# EasyEDA schematic Sheet_1.json
TITLE: Sheet_1; REV: 1.0; Date: 2025-07-18; Sheet: 1/1; Drawn By: hunarbatra1414; Company: Your Company
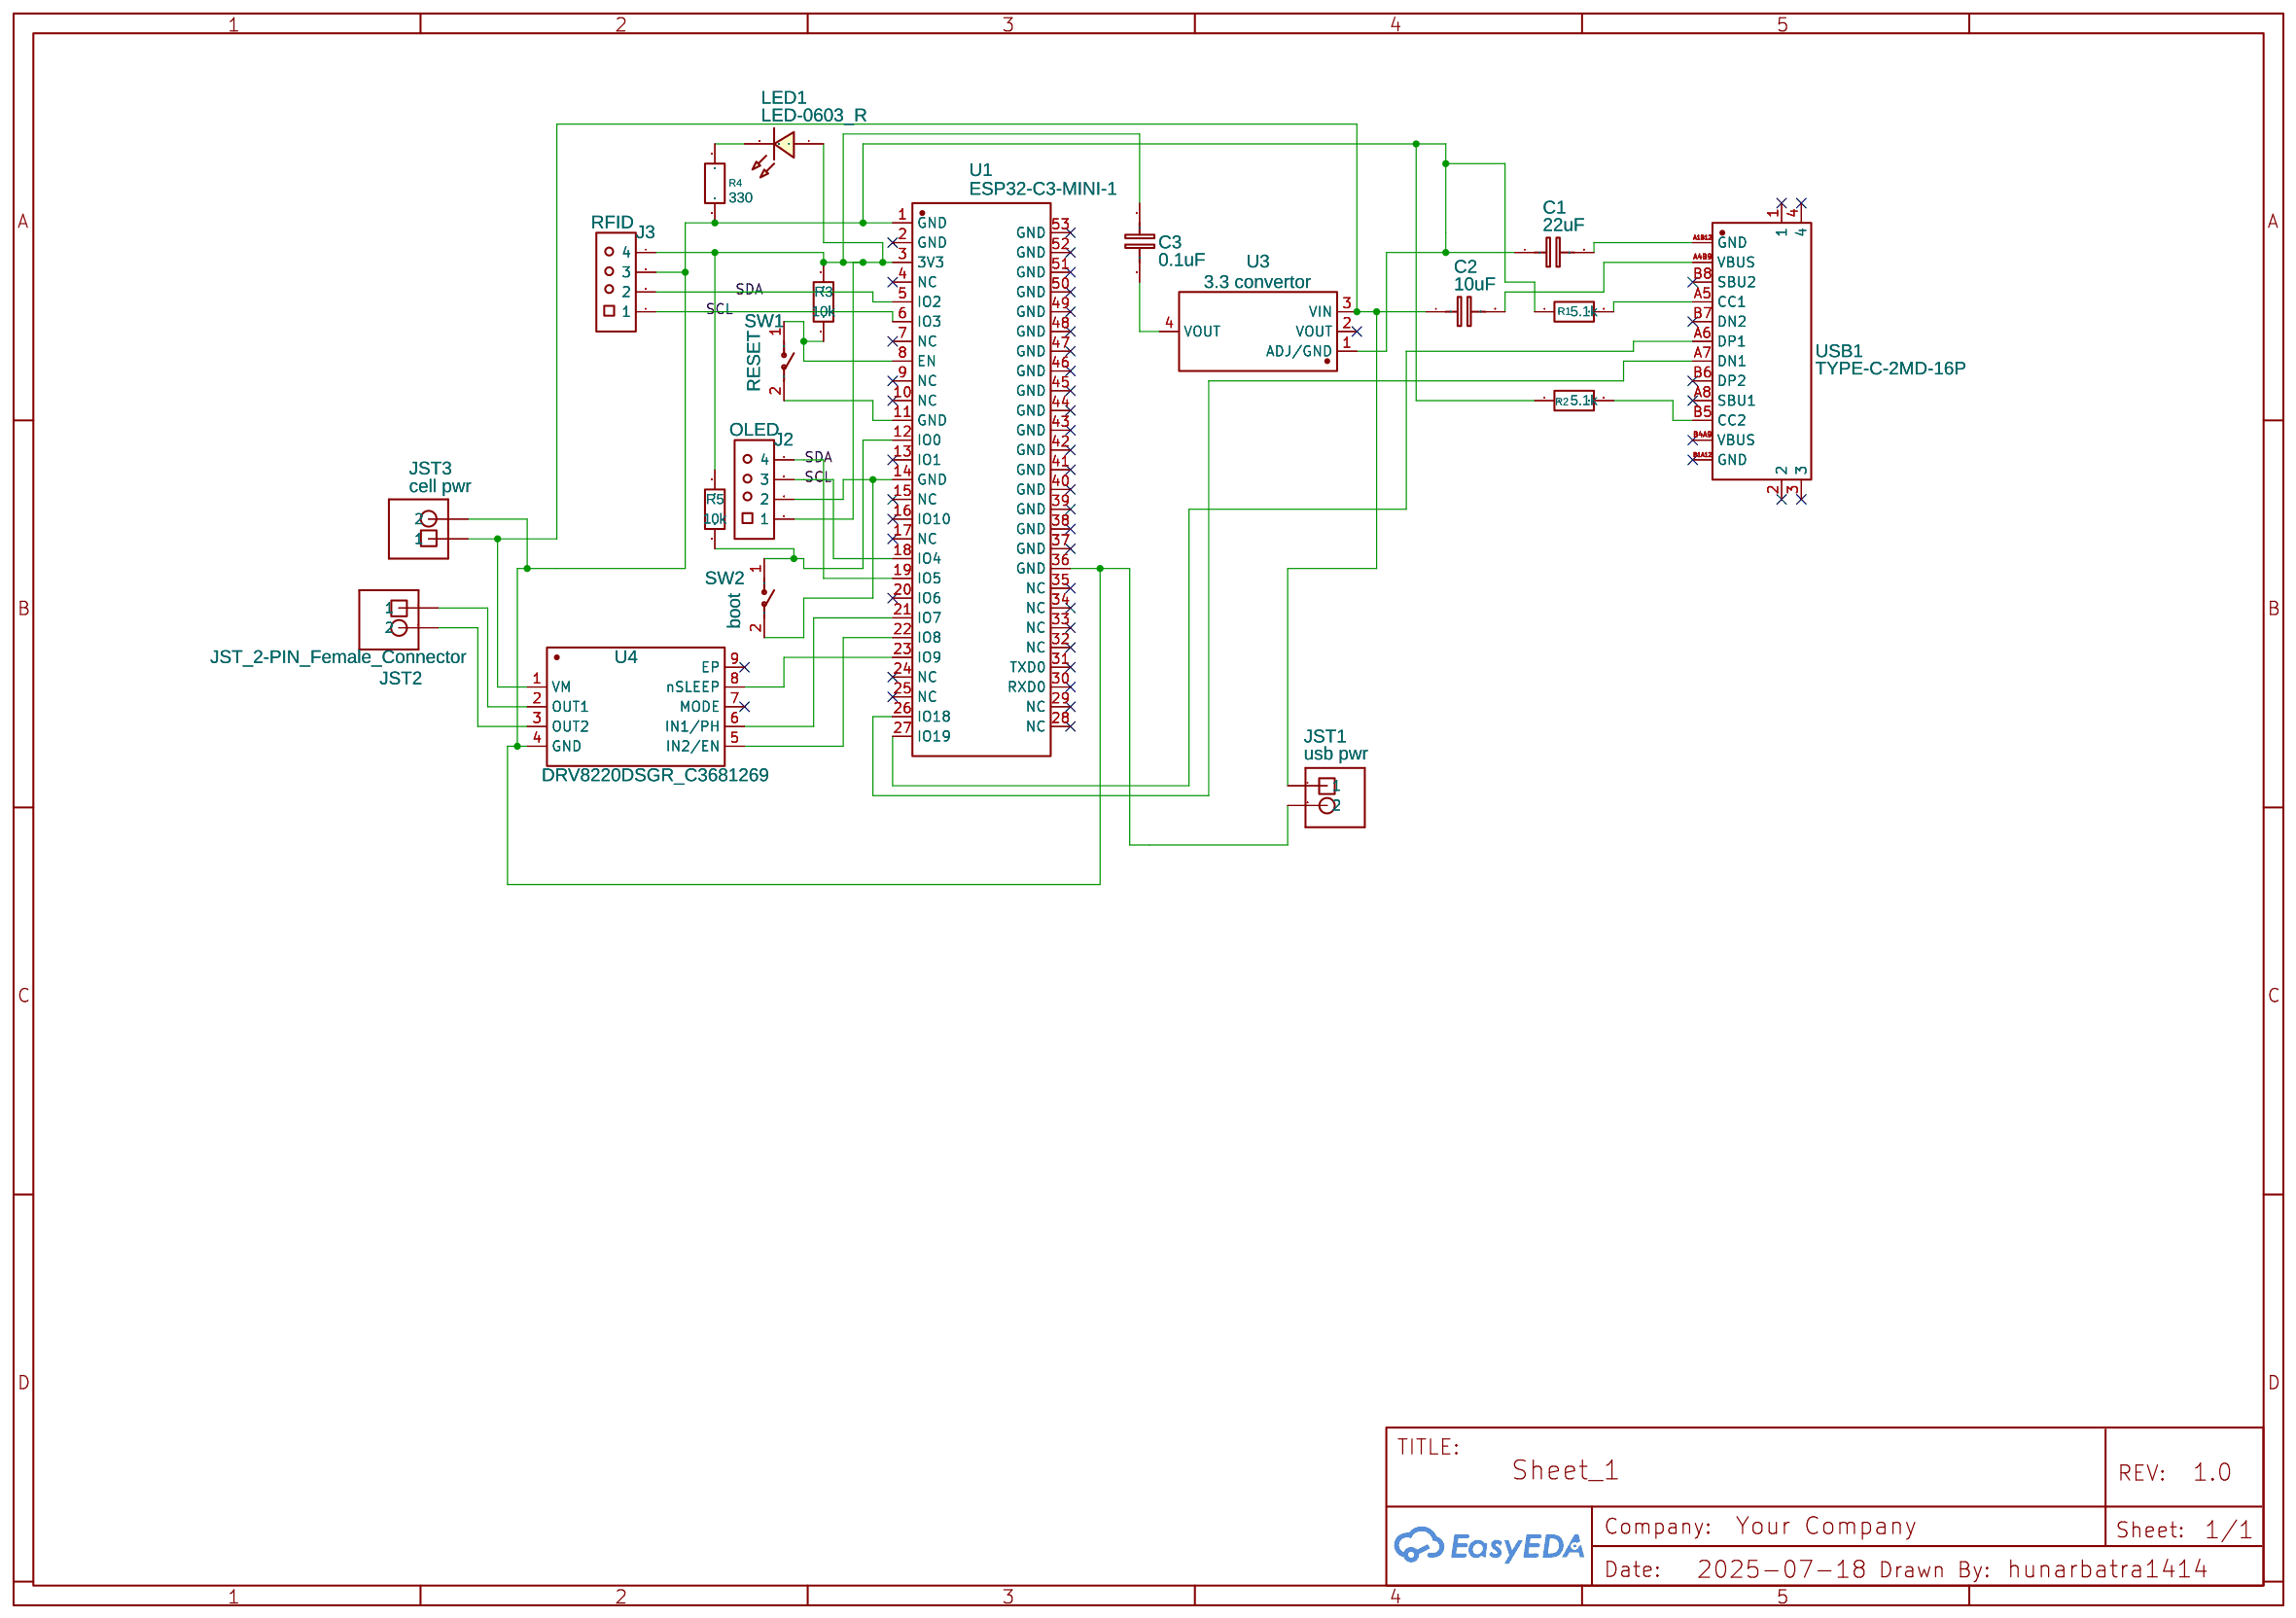
[diagram p0: schematic sheet]

## Parts
C1  22uF  [C0603]
C2  10uF  [C0603]
C3  0.1uF  [C0603]
J2  OLED  [JST-4PIN_2.54MM]
J3  RFID  [JST-4PIN_2.54MM]
JST1  usb pwr  [JST_XH_2_PIN_TOP_ENTRY]
JST2  JST_2-PIN_Female_Connector  [JST_XH_2_PIN_TOP_ENTRY]
JST3  cell pwr  [JST_XH_2_PIN_TOP_ENTRY]
LED1  LED-0603_R  [LED0603_RED]
R1  5.1k  [R0603]
R2  5.1k  [R0603]
R3  10k  [R0603]
R4  330  [R0603]
R5  10k  [R0603]
SW1  RESET  [SW-SMD_L3.0-W2.5-P3.40-LS4.0-EH]
SW2  boot  [SW-SMD_L3.0-W2.5-P3.40-LS4.0-EH]
U1  ESP32-C3-MINI-1  [WIFIM-SMD_ESP32-C3-MINI-1]
U3  3.3 convertor  [SOT-223_L6.5-W3.5-P2.30-LS7.0-BR]
U4  DRV8220DSGR_C3681269  [WSON-8_L2.0-W2.0-P0.50-TL-EP]
USB1  TYPE-C-2MD-16P  [USB-C-SMD_TYPE-C-2MD-16P]

## Library data of the parts
C1-C3 = C_0603_EU: Contributor: LCEDA_Lib
J2 J3 = JST-4PIN_2.54MM
JST1-JST3 = JST_2-PIN_Female_Connector: Contributor: NavinL
LED1 = LED-0603_R: Manufacturer: EVERLIGHT(台湾亿光); Manufacturer Part: 19-217/R6C-AL1M2VY/3T; Supplier Part: C72044; Supplier: LCSC; Contributor: LCEDA_01
R1-R5 = R_0603_EU: Contributor: LCEDA_Lib
SW1 SW2 = TS-3025-A-C-A: Supplier: LCSC; Supplier Part: C21262543; Manufacturer: XKB Connection(中国星坤); Contributor: lcsc; JLCPCB Part Class: Extended Part
U1 = ESP32-C3-MINI-1: Contributor: lcsc; Supplier: LCSC; Supplier Part: C5290152; Manufacturer: RF Crazy(智汉); JLCPCB Part Class: Extended Part
U3 = AMS1117-3.3_C351785: Contributor: LCSC; Supplier: LCSC; Supplier Part: C351785; Manufacturer: PUOLOP(迪浦); Manufacturer Part: AMS1117-3.3; JLCPCB Part Class: Extended Part
U4 = DRV8220DSGR_C3681269: Contributor: lcsc; Supplier: LCSC; Supplier Part: C3681269; Manufacturer: TI(德州仪器); Manufacturer Part: DRV8220DSGR; JLCPCB Part Class: Extended Part
USB1 = TYPE-C-2MD-16P: Supplier: LCSC; Supplier Part: C42418793; Manufacturer: JXTCONN(聚兴泰); Contributor: lcsc

## Nets
SCL: J2.3 J3.1 U1.6(IO3) U1.18(IO4)
SDA: J2.4 J3.2 U1.5(IO2) U1.19(IO5)
Net-(C1-1): C1.1 J3.3 JST1.2 JST3.2 R1.1 R2.1 R4.1 U1.1(GND) U1.36(GND) U3.1(ADJ/GND) U4.4(GND)
Net-(C1-2): C1.2 USB1.A1B12(GND)
Net-(C2-1): C2.1 JST1.1 JST3.1 U3.3(VIN) U4.1(VM)
Net-(C2-2): C2.2 USB1.A4B9(VBUS)
Net-(C3-1): C3.1 J2.1 J3.4 LED1.1 R3.2 R5.2 U1.3(3V3)
Net-(C3-2): C3.2 U3.4(VOUT)
Net-(J2-2): J2.2 SW2.2 U1.14(GND)
Net-(JST2-1): JST2.1 U4.2(OUT1)
Net-(JST2-2): JST2.2 U4.3(OUT2)
Net-(LED1-2): LED1.2 R4.2
Net-(R1-2): R1.2 USB1.A5(CC1)
Net-(R2-2): R2.2 USB1.B5(CC2)
Net-(R3-1): R3.1 SW1.1 U1.8(EN)
Net-(R5-1): R5.1 SW2.1 U1.12(IO0)
Net-(SW1-2): SW1.2 U1.11(GND)
Net-(U1-21): U1.21(IO7) U4.6(IN1/PH)
Net-(U1-22): U1.22(IO8) U4.5(IN2/EN)
Net-(U1-23): U1.23(IO9) U4.8(nSLEEP)
Net-(U1-26): U1.26(IO18) USB1.A7(DN1)
Net-(U1-27): U1.27(IO19) USB1.A6(DP1)

Not connected (* = marked no-connect by the designer): U1 2(GND)* 4(NC)* 7(NC)* 9(NC)* 10(NC)* 13(IO1)* 15(NC)* 16(IO10)* 17(NC)* 20(IO6)* 24(NC)* 25(NC)* 28(NC)* 29(NC)* 30(RXD0)* 31(TXD0)* 32(NC)* 33(NC)* 34(NC)* 35(NC)* 37(GND)* 38(GND)* 39(GND)* 40(GND)* 41(GND)* 42(GND)* 43(GND)* 44(GND)* 45(GND)* 46(GND)* 47(GND)* 48(GND)* 49(GND)* 50(GND)* 51(GND)* 52(GND)* 53(GND)*; U3 2(VOUT)*; U4 7(MODE)* 9(EP)*; USB1 1* 2* 3* 4* A8(SBU1)* B1A12(GND)* B4A9(VBUS)* B6(DP2)* B7(DN2)* B8(SBU2)*
